# Altium schematic sheet Channel.SchDoc
size A4
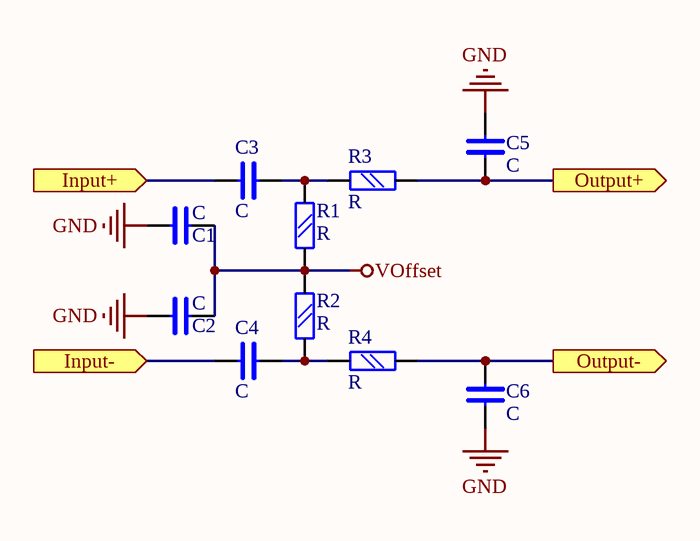
[diagram p0: Channel.SchDoc]

## Parts
C1  C  [chip0603]
C2  C  [chip0603]
C3  C  [chip0603]
C4  C  [chip0603]
C5  C  [chip0603]
C6  C  [chip0603]
R1  R  [chip0603]
R2  R  [chip0603]
R3  R  [chip0603]
R4  R  [chip0603]

## Ports
Input+ (in), Input- (in), Output+ (out), Output- (out)

## Nets
GND: C1.1 C2.1 C5.2 C6.1
VOffset: C1.2 C2.2 R1.1 R2.2
Input+: C3.1 ; port Input+
Input-: C4.1 ; port Input-
Output+: C5.1 R3.2 ; port Output+
Output-: C6.2 R4.2 ; port Output-
NetC3_2: C3.2 R1.2 R3.1
NetC4_2: C4.2 R2.1 R4.1

## Library data of the parts
C1-C6 = C: Text Field1: 20; Text Field2: 10
R1-R4 = R: Text Field1: 20; Text Field2: 20